# EAGLE design Joystick_final_rev02 (EAGLE 9.6.2)
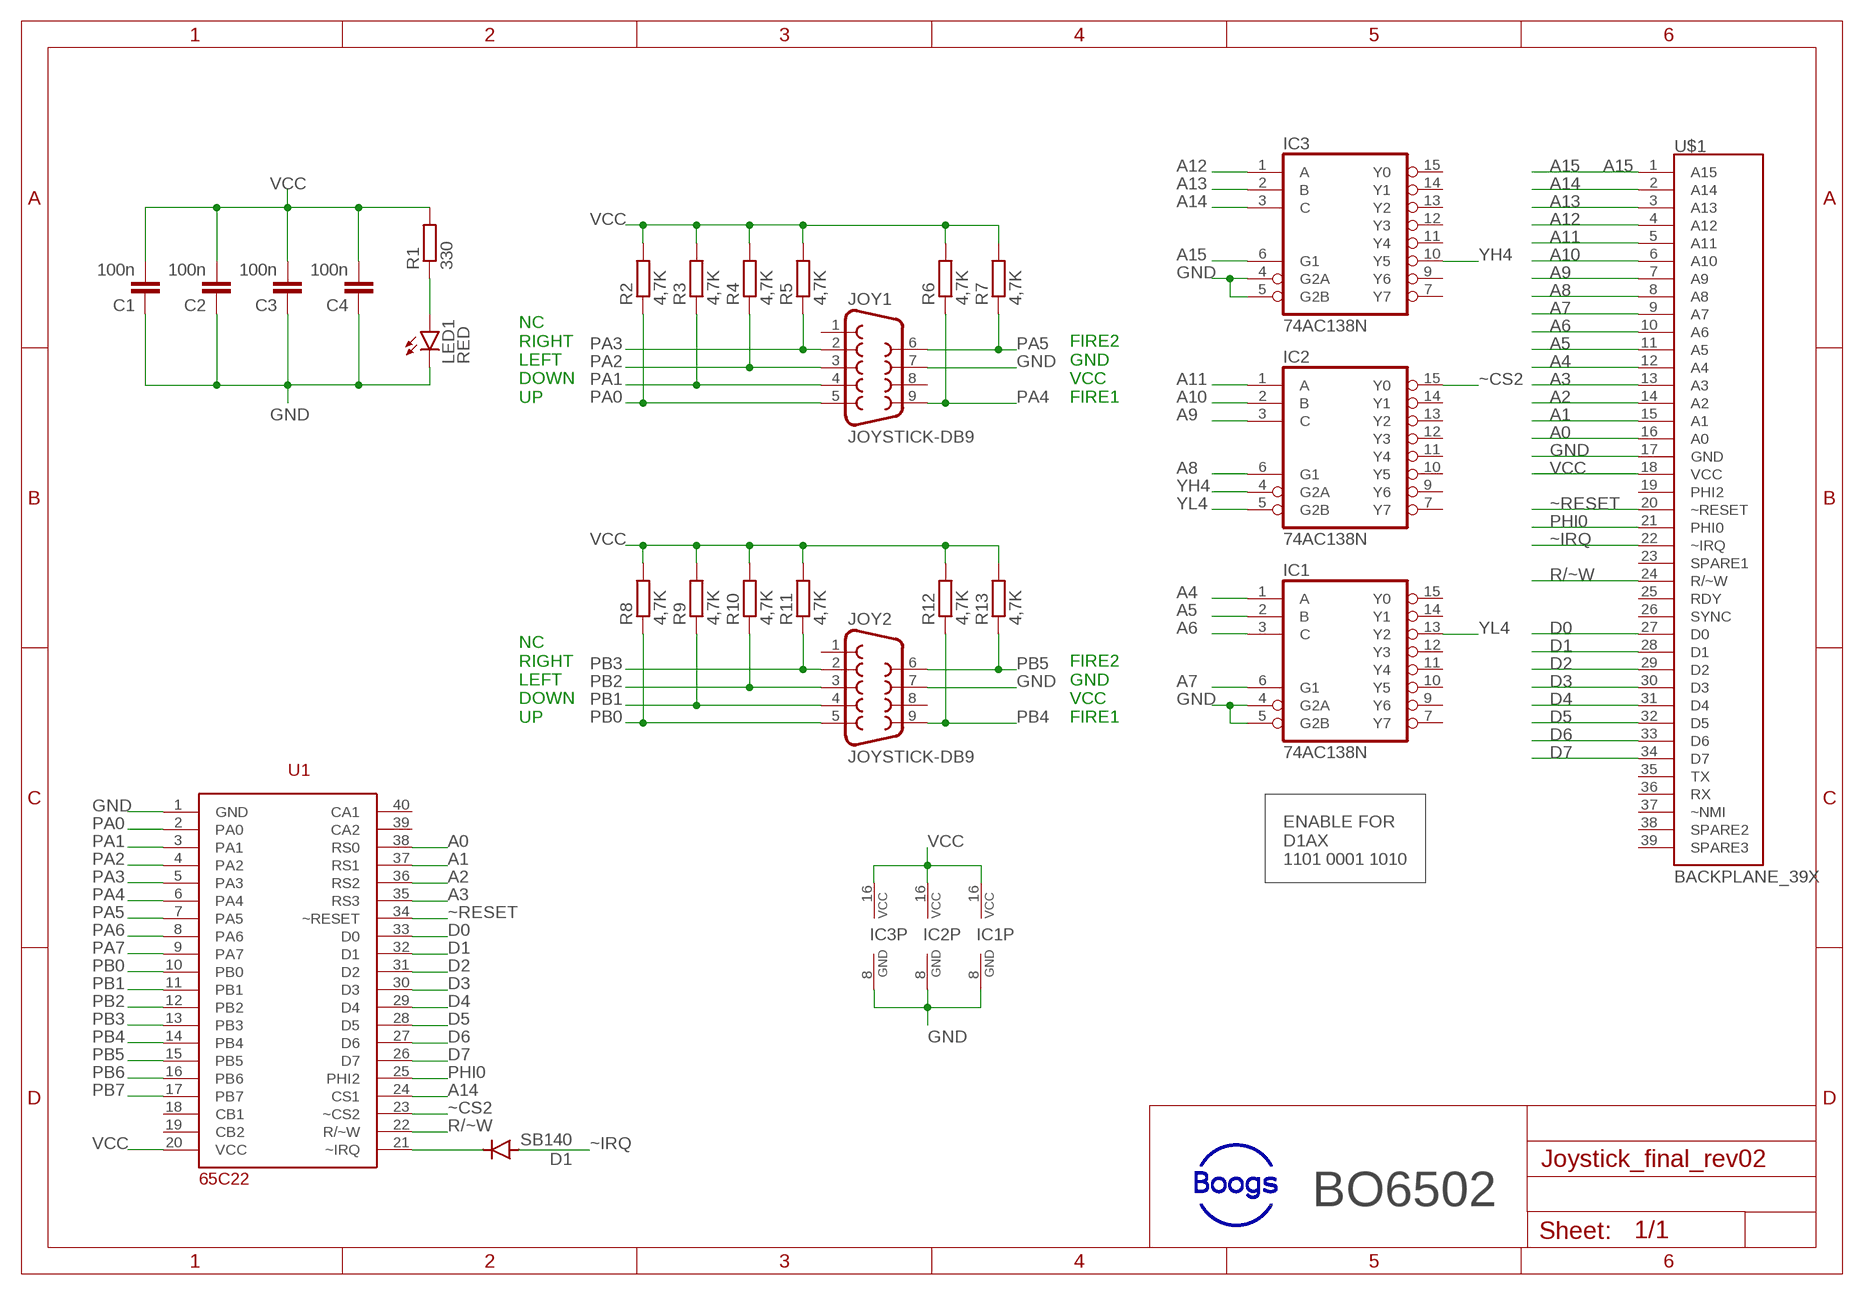
[diagram p0: schematic, sheet 1]

## Parts
C1  100n  C-EU025-025X050  [C025-025X050]
C2  100n  C-EU025-025X050  [C025-025X050]
C3  100n  C-EU025-025X050  [C025-025X050]
C4  100n  C-EU025-025X050  [C025-025X050]
D1  SB140  1N4004  [DO41-10]
IC1  74AC138N  [DIL16]
IC2  74AC138N  [DIL16]
IC3  74AC138N  [DIL16]
JOY1  JOYSTICK-DB9  F09HP  [F09HP]
JOY2  JOYSTICK-DB9  F09HP  [F09HP]
LED1  RED  LED5MM  [LED5MM]
R1  330  R-EU_0207/10  [0207/10]
R2  4,7K  R-EU_0207/10  [0207/10]
R3  4,7K  R-EU_0207/10  [0207/10]
R4  4,7K  R-EU_0207/10  [0207/10]
R5  4,7K  R-EU_0207/10  [0207/10]
R6  4,7K  R-EU_0207/10  [0207/10]
R7  4,7K  R-EU_0207/10  [0207/10]
R8  4,7K  R-EU_0207/10  [0207/10]
R9  4,7K  R-EU_0207/10  [0207/10]
R10  4,7K  R-EU_0207/10  [0207/10]
R11  4,7K  R-EU_0207/10  [0207/10]
R12  4,7K  R-EU_0207/10  [0207/10]
R13  4,7K  R-EU_0207/10  [0207/10]
U1  65C22  [DIL40]
U$1  BACKPLANE_39X  [BP_39X]

## Nets
A0: U1.38(RS0) U$1.16(A0)
A1: U1.37(RS1) U$1.15(A1)
A2: U1.36(RS2) U$1.14(A2)
A3: U1.35(RS3) U$1.13(A3)
A4: IC1.1(A) U$1.12(A4)
A5: IC1.2(B) U$1.11(A5)
A6: IC1.3(C) U$1.10(A6)
A7: IC1.6(G1) U$1.9(A7)
A8: IC2.6(G1) U$1.8(A8)
A9: IC2.3(C) U$1.7(A9)
A10: IC2.2(B) U$1.6(A10)
A11: IC2.1(A) U$1.5(A11)
A12: IC3.1(A) U$1.4(A12)
A13: IC3.2(B) U$1.3(A13)
A14: IC3.3(C) U1.24(CS1) U$1.2(A14)
A15: IC3.6(G1) U$1.1(A15)
D0: U1.33(D0) U$1.27(D0)
D1: U1.32(D1) U$1.28(D1)
D2: U1.31(D2) U$1.29(D2)
D3: U1.30(D3) U$1.30(D3)
D4: U1.29(D4) U$1.31(D4)
D5: U1.28(D5) U$1.32(D5)
D6: U1.27(D6) U$1.33(D6)
D7: U1.26(D7) U$1.34(D7)
GND: C1.1 C2.1 C3.1 C4.1 IC1.4(G2A) IC1.5(G2B) IC1.8(GND) IC2.8(GND) IC3.4(G2A) IC3.5(G2B) IC3.8(GND) JOY1.7 JOY2.7 LED1.K(C) U1.1(GND) U$1.17(GND)
N$1: D1.C U1.21(~IRQ)
N$6: LED1.A R1.1
PA0: JOY1.5 R2.1 U1.2(PA0)
PA1: JOY1.4 R3.1 U1.3(PA1)
PA2: JOY1.3 R4.1 U1.4(PA2)
PA3: JOY1.2 R5.1 U1.5(PA3)
PA4: JOY1.9 R6.1 U1.6(PA4)
PA5: JOY1.6 R7.1 U1.7(PA5)
PA6: U1.8(PA6)
PA7: U1.9(PA7)
PB0: JOY2.5 R8.1 U1.10(PB0)
PB1: JOY2.4 R9.1 U1.11(PB1)
PB2: JOY2.3 R10.1 U1.12(PB2)
PB3: JOY2.2 R11.1 U1.13(PB3)
PB4: JOY2.9 R12.1 U1.14(PB4)
PB5: JOY2.6 R13.1 U1.15(PB5)
PB6: U1.16(PB6)
PB7: U1.17(PB7)
PHI0: U1.25(PHI2) U$1.21(PHI0)
R/~W: U1.22(R/~W) U$1.24(R/~W)
VCC: C1.2 C2.2 C3.2 C4.2 IC1.16(VCC) IC2.16(VCC) IC3.16(VCC) R1.2 R2.2 R3.2 R4.2 R5.2 R6.2 R7.2 R8.2 R9.2 R10.2 R11.2 R12.2 R13.2 U1.20(VCC) U$1.18(VCC)
YH4: IC2.4(G2A) IC3.10(Y5)
YL4: IC1.13(Y2) IC2.5(G2B)
~CS2: IC2.15(Y0) U1.23(~CS2)
~IRQ: D1.A U$1.22(~IRQ)
~RESET: U1.34(~RESET) U$1.20(~RESET)
Unconnected: IC1.7(Y7) IC1.9(Y6) IC1.10(Y5) IC1.11(Y4) IC1.12(Y3) IC1.14(Y1) IC1.15(Y0) IC2.7(Y7) IC2.9(Y6) IC2.10(Y5) IC2.11(Y4) IC2.12(Y3) IC2.13(Y2) IC2.14(Y1) IC3.7(Y7) IC3.9(Y6) IC3.11(Y4) IC3.12(Y3) IC3.13(Y2) IC3.14(Y1) IC3.15(Y0) JOY1.1 JOY1.8 JOY2.1 JOY2.8 U1.18(CB1) U1.19(CB2) U1.39(CA2) U1.40(CA1) U$1.19(PHI2) U$1.23(SPARE1) U$1.25(RDY) U$1.26(SYNC) U$1.35(TX) U$1.36(RX) U$1.37(~NMI) U$1.38(SPARE2) U$1.39(SPARE3)

## Notes on the sheet
- NC
  RIGHT
  LEFT
  DOWN
  UP
- FIRE2
  GND
  VCC
  FIRE1
- NC
  RIGHT
  LEFT
  DOWN
  UP
- FIRE2
  GND
  VCC
  FIRE1
- ENABLE FOR
  D1AX
  1101 0001 1010
- BO6502

## Library data of the parts
C1-C4 = rcl:C-EU: CAPACITOR, European symbol; SPICEPREFIX: C
D1 = diode:1N4004: DIODE general purpose rectifier, 1 A
IC1-IC3 = 74xx-eu:74*138: 3-line to 8-line DECODER/DEMULTIPLEXER
JOY1 JOY2 = con-subd:F09: SUB-D; OC_FARNELL: unknown; OC_NEWARK: unknown
LED1 = led:LED: LED OSRAM: - CHIPLED LG R971, LG N971, LY N971, LG Q971, LY Q971, LO R971, LY R971 LH N974, LH R974 LS Q976, LO Q976, LY Q976 LO Q996 - Hyper CHIPLED LW Q18S LB Q993, LB Q99A, LB R99A - SideLED LS A670, LO A670, LY A670, LG A670, LP A670 LB A673, LV A673, LT A673, LW A673 LH A674 LY A675 LS A676, LA A676, LO A676, LY A676, LW A676 LS A679, LY A679, LG A679 - Hyper Micro SIDELED® LS Y876, LA Y876, LO Y876, LY Y876 LT Y87S - SmartLED LW L88C, LW L88S LB L89C, LB L89S, LG L890 LS L89K, LO L89K, LY L89K LS L896, LA L896, LO L896, LY L896 - TOPLED LS T670, LO T670, LY T670, LG T670, LP T670 LSG T670, LSP T670, LSY T670, LOP T670, LYG T670 LG T671, LOG T671, LSG T671 LB T673, LV T673, LT T673, LW T673 LH T674 LS T676, LA T676, LO T676, LY T676, LB T676, LH T676, LSB T676, LW T676 LB T67C, LV T67C, LT T67C, LS T67K, LO T67K, LY T67K, LW E67C LS E67B, LA E67B, LO E67B, LY E67B, LB E67C, LV E67C, LT E67C LW T67C LS T679, LY T679, LG T679 LS T770, LO T770, LY T770, LG T770, LP T770 LB T773, LV T773, LT T773, LW T773 LH T774 LS E675, LA E675, LY E675, LS T675 LS T776, LA T776, LO T776, LY T776, LB T776 LHGB T686 LT T68C, LB T68C - Hyper Mini TOPLED® LB M676 - Mini TOPLED Santana® LG M470 LS M47K, LO M47K, LY M47K Source: http://www.osram.convergy.de LUXEON: - LUMILED® LXK2-PW12-R00, LXK2-PW12-S00, LXK2-PW14-U00, LXK2-PW14-V00 LXK2-PM12-R00, LXK2-PM12-S00, LXK2-PM14-U00 LXK2-PE12-Q00, LXK2-PE12-R00, LXK2-PE12-S00, LXK2-PE14-T00, LXK2-PE14-U00 LXK2-PB12-K00, LXK2-PB12-L00, LXK2-PB12-M00, LXK2-PB14-N00, LXK2-PB14-P00, LXK2-PB14-Q00 LXK2-PR12-L00, LXK2-PR12-M00, LXK2-PR14-Q00, LXK2-PR14-R00 LXK2-PD12-Q00, LXK2-PD12-R00, LXK2-PD12-S00 LXK2-PH12-R00, LXK2-PH12-S00 LXK2-PL12-P00, LXK2-PL12-Q00, LXK2-PL12-R00 Source: www.luxeon.com KINGBRIGHT: KA-3528ASYC Source: www.kingbright.com
R1-R13 = rcl:R-EU_: RESISTOR, European symbol; SPICEPREFIX: R
U1 = 65xx_family:65C22
U$1 = 65xx_family:BACKPLANE_39X; A15: A15

## Board
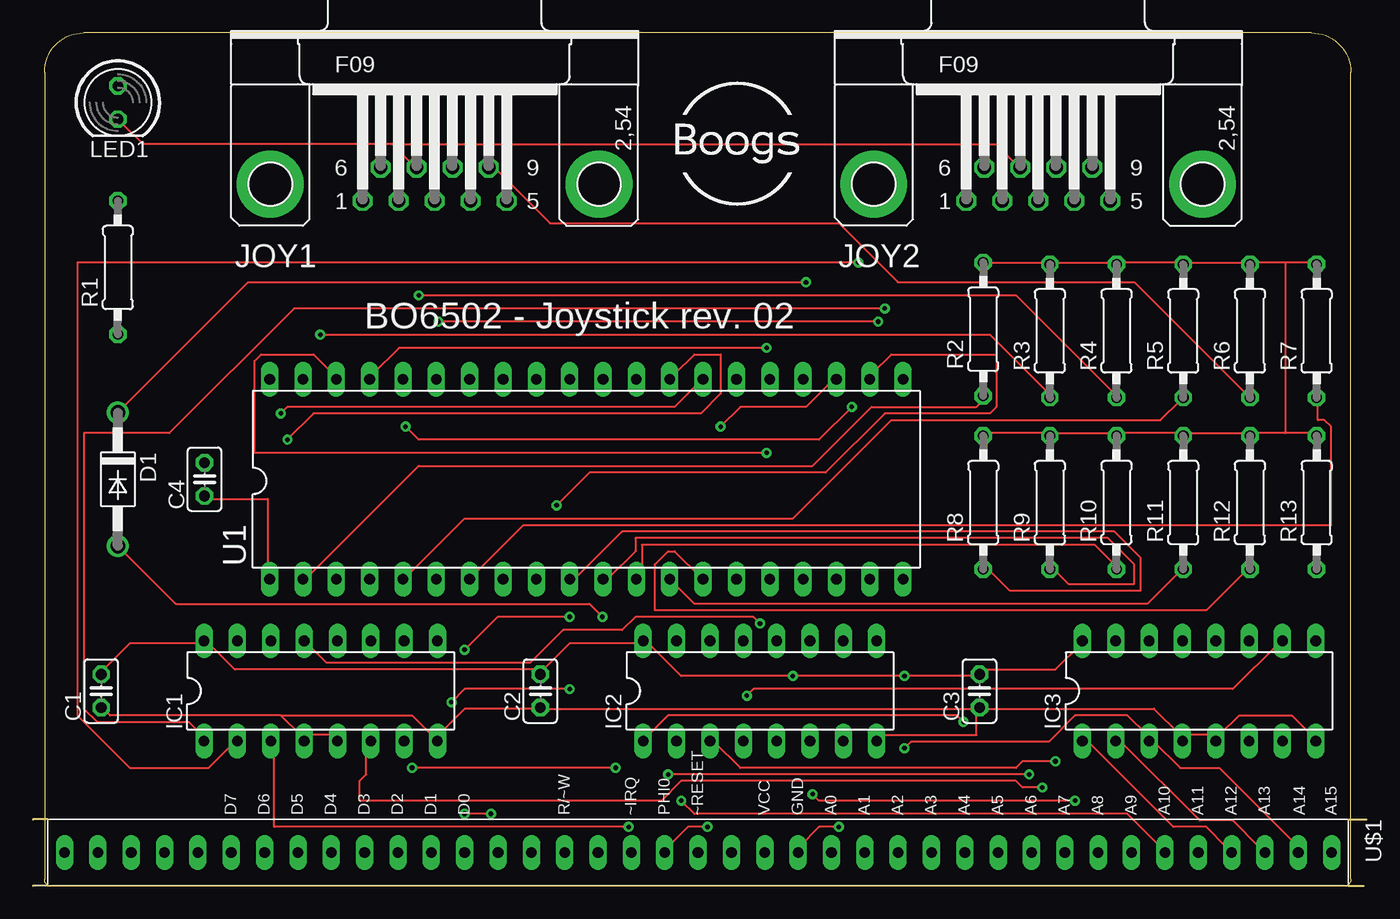
[diagram p1: board, top side]
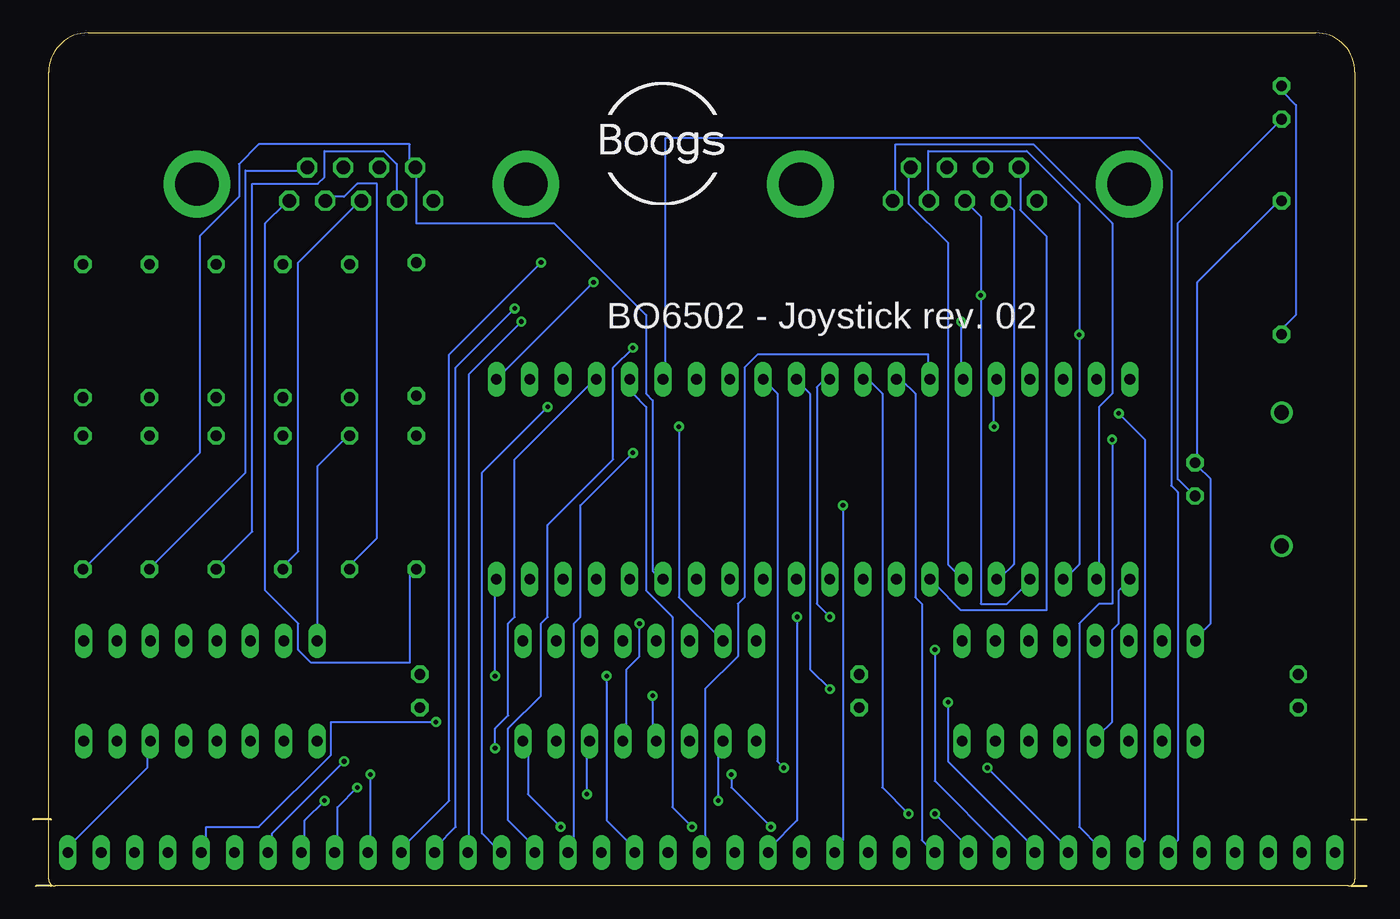
[diagram p2: board, bottom side, seen from below]

Size 101.6 x 65 mm. Coordinates in mm from the lower left corner, seen from the top.
Outline: 1.14,5.08 0,5.08
Outline: 1.14,0 0,0
Outline: 100.2,5.08 101.6,5.08
Outline: 100.2,0 101.35,0
Outline: 1.39,0 99.89,0 arc90 100.39,0.5 100.39,62 arc90 97.39,65 3.89,65 arc90 0.89,62 0.89,0.5 arc90 1.39,0
Copper layers (1*16): Top 0.035mm / dielectric 1.5mm / Bottom 0.035mm
Design rules "default *": minimum track width 6mil, minimum drill 0.35mm, track to track 10mil, track to pad 10mil, pad to pad 10mil, via to via 10mil, smd to smd 6mil, copper to edge 40mil, drill to drill 6mil, minimum pad ring 10mil, minimum via ring 8mil, stop-mask expansion 4mil, vias tented up to drill 15mil, thermal gap 10mil

### Footprints (pad centres in the part's own frame; a part is rotated, then mirrored left to right if it is on the bottom)
C025-025X050 = drill 0.813 octagon: 1 -1.27,0; 2 1.27,0
DO41-10 = drill 1.118: A 5.08,0; C -5.08,0
DIL16 = drill 0.813 long: 1 -8.89,-3.81; 2 -6.35,-3.81; 3 -3.81,-3.81; 4 -1.27,-3.81; 5 1.27,-3.81; 6 3.81,-3.81; 7 6.35,-3.81; 8 8.89,-3.81; 9 8.89,3.81; 10 6.35,3.81; 11 3.81,3.81; 12 1.27,3.81; 13 -1.27,3.81; 14 -3.81,3.81; 15 -6.35,3.81; 16 -8.89,3.81
F09HP = drill 1.016 octagon: 1 -5.486,-1.27; 2 -2.743,-1.27; 3 0,-1.27; 4 2.743,-1.27; 5 5.486,-1.27; 6 -4.115,1.27; 7 -1.372,1.27; 8 1.372,1.27; 9 4.115,1.27 | drill 3.302 pad 5.08: G1 -12.522,0; G2 12.522,0
LED5MM = drill 0.813 octagon: A -1.27,0; K 1.27,0
0207/10 = drill 0.813 octagon: 1 -5.08,0; 2 5.08,0
DIL40 = drill 0.813 long: 1 -24.13,-7.62; 2 -21.59,-7.62; 3 -19.05,-7.62; 4 -16.51,-7.62; 5 -13.97,-7.62; 6 -11.43,-7.62; 7 -8.89,-7.62; 8 -6.35,-7.62; 9 -3.81,-7.62; 10 -1.27,-7.62; 11 1.27,-7.62; 12 3.81,-7.62; 13 6.35,-7.62; 14 8.89,-7.62; 15 11.43,-7.62; 16 13.97,-7.62; 17 16.51,-7.62; 18 19.05,-7.62; 19 21.59,-7.62; 20 24.13,-7.62; 21 24.13,7.62; 22 21.59,7.62; 23 19.05,7.62; 24 16.51,7.62; 25 13.97,7.62; 26 11.43,7.62; 27 8.89,7.62; 28 6.35,7.62; 29 3.81,7.62; 30 1.27,7.62; 31 -1.27,7.62; 32 -3.81,7.62; 33 -6.35,7.62; 34 -8.89,7.62; 35 -11.43,7.62; 36 -13.97,7.62; 37 -16.51,7.62; 38 -19.05,7.62; 39 -21.59,7.62; 40 -24.13,7.62
BP_39X = drill 0.813 long: 1 1.27,59.69; 2 1.27,57.15; 3 1.27,54.61; 4 1.27,52.07; 5 1.27,49.53; 6 1.27,46.99; 7 1.27,44.45; 8 1.27,41.91; 9 1.27,39.37; 10 1.27,36.83; 11 1.27,34.29; 12 1.27,31.75; 13 1.27,29.21; 14 1.27,26.67; 15 1.27,24.13; 16 1.27,21.59; 17 1.27,19.05; 18 1.27,16.51; 19 1.27,13.97; 20 1.27,11.43; 21 1.27,8.89; 22 1.27,6.35; 23 1.27,3.81; 24 1.27,1.27; 25 1.27,-1.27; 26 1.27,-3.81; 27 1.27,-6.35; 28 1.27,-8.89; 29 1.27,-11.43; 30 1.27,-13.97; 31 1.27,-16.51; 32 1.27,-19.05; 33 1.27,-21.59; 34 1.27,-24.13; 35 1.27,-26.67; 36 1.27,-29.21; 37 1.27,-31.75; 38 1.27,-34.29; 39 1.27,-36.83

### Placement (x,y rotation side)
C1  5.21,14.86 90 top
C2  38.66,14.86 90 top
C3  72.11,14.86 90 top
C4  13.08,30.99 90 top
D1  6.48,30.99 270 top
IC1  21.93,14.86 0 top
IC2  55.38,14.86 0 top
IC3  88.84,14.86 0 top
JOY1  30.61,53.47 0 top
JOY2  76.58,53.47 0 top
LED1  6.48,59.69 270 top
R1  6.48,47.12 90 top
R2  72.39,42.42 90 top
R3  77.47,42.29 90 top
R4  82.55,42.29 90 top
R5  87.63,42.29 90 top
R6  92.71,42.29 90 top
R7  97.79,42.29 90 top
R8  72.39,29.21 90 top
R9  77.47,29.21 90 top
R10  82.55,29.21 90 top
R11  87.63,29.21 90 top
R12  92.71,29.21 90 top
R13  97.79,29.21 90 top
U1  42.16,30.99 0 top
U$1  39.24,3.81 270 top

### Tracks (layer width: path | path; a pad name or v marks a point on that pad's centre or on a via)
A0  (via drill 0.35)
  Top 0.152: v55.89,33 16.89,33 16.89,40 17.39,40.5 21.39,40.5 22.89,39 U1.38
  Bottom 0.152: v55.89,33 59.89,29 59.89,20.5 60.39,20 60.39,3 U$1.16
A1  (via drill 0.35)
  Top 0.152: v55.89,41 27.89,41 25.89,39 U1.37
  Bottom 0.152: v55.89,41 57.39,39.5 57.39,32.5 62.39,27.5 62.39,20.5 62.89,20 62.89,14.5 65.39,12 65.39,5 63.39,3 U$1.15
A2  (via drill 0.35)
  Top 0.152: v28.39,35 29.39,34 59.89,34 v62.39,36.5
  Bottom 0.152: v28.39,35 28.39,38.5 U1.36 | v62.39,36.5 67.39,31.5 67.39,4 66.39,3 U$1.14
A3  (via drill 0.35)
  Top 0.152: v64.39,43 v30.89,43
  Bottom 0.152: v30.89,43 30.89,39 U1.35 | v64.39,43 68.39,39 68.39,3 U$1.13
A4  (via drill 0.35)
  Top 0.152: v64.89,44 19.89,44 10.39,34.5 3.89,34.5 3.89,13.5 4.89,12.5 11.89,12.5 12.89,11.5 IC1.1
  Bottom 0.152: v64.89,44 69.39,39.5 69.39,4.5 70.89,3 U$1.12
A5  (via drill 0.35)
  Top 0.152: v62.89,47.5 3.39,47.5 3.39,13 7.39,9 13.39,9 15.39,11 IC1.2
  Bottom 0.152: v62.89,47.5 69.89,40.5 69.89,6.5 73.39,3 U$1.11
A6  (via drill 0.35)
  Top 0.152: v45.39,4.5 18.39,4.5 18.39,11 IC1.3 | v75.89,8.5 v48.39,8.5
  Bottom 0.152: v45.39,4.5 48.39,7.5 v48.39,8.5 | v75.89,8.5 75.89,3 U$1.10
A7  (via drill 0.35)
  Top 0.152: v76.89,7.5 75.39,7.5 74.89,8 49.39,8 47.89,6.5 24.89,6.5 24.89,8 25.39,8.5 25.39,11 IC1.6
  Bottom 0.152: v76.89,7.5 78.39,6 78.39,3 U$1.9
A8  (via drill 0.35)
  Top 0.152: v59.39,7 59.89,6.5 v79.39,6.5
  Bottom 0.152: v59.39,7 59.39,11 IC2.6 | v79.39,6.5 80.89,5 80.89,3 U$1.8
A9  (via drill 0.35)
  Top 0.152: v77.89,9.5 75.39,9.5 74.89,9 53.89,9 51.89,11 IC2.3
  Bottom 0.152: v77.89,9.5 83.39,4 83.39,3 U$1.7
A10  (via drill 0.35)
  Top 0.152: v49.39,6.5 50.39,5.5 83.39,5.5 85.89,3 U$1.6
  Bottom 0.152: v49.39,6.5 49.39,11 IC2.2
A11  (via drill 0.35)
  Top 0.152: v70.89,12.5 70.39,13 48.39,13 46.89,11.5 IC2.1
  Bottom 0.152: v70.89,12.5 78.89,12.5 78.89,10 84.39,4.5 88.39,4.5 88.39,3 U$1.5
A12
  Top 0.152: IC3.1 80.39,11 86.89,4.5 89.39,4.5 90.89,3 U$1.4
A13
  Top 0.152: IC3.2 82.89,11 88.89,5 91.39,5 93.39,3 U$1.3
A14  (via drill 0.35)
  Top 0.152: v66.39,10.5 66.89,11 77.39,11 79.39,13 83.39,13 84.89,11.5 IC3.3 85.39,11 87.39,9 90.39,9 96.39,3 U$1.2
  Bottom 0.152: v66.39,10.5 66.39,12 65.39,13 65.39,20 64.89,20.5 64.89,32.5 58.89,38.5 U1.24
A15
  Bottom 0.152: U$1.1 98.89,3 92.89,9 92.89,11 IC3.6
D0
  Bottom 0.152: U$1.27 33.39,3 33.89,3.5 33.89,21.5 34.39,22 34.39,37.5 35.39,38.5 U1.33
D1  (via drill 0.35)
  Top 0.152: v34.89,5.5 v32.89,5.5
  Bottom 0.152: v32.89,5.5 30.39,3 U$1.28 | v34.89,5.5 36.89,7.5 36.89,37.5 37.89,38.5 U1.32
D2  (via drill 0.35)
  Top 0.152: v32.89,18 35.39,20.5 v40.89,20.5
  Bottom 0.152: v32.89,18 32.89,8 27.89,3 U$1.29 | v40.89,20.5 41.89,21.5 41.89,38 41.39,38.5 U1.31
D3  (via drill 0.35)
  Top 0.152: v31.89,14 32.89,15 v40.89,15
  Bottom 0.152: v31.89,14 31.89,9.5 25.39,3 U$1.30 | v40.89,15 42.39,16.5 42.39,37.5 43.39,38.5 U1.30
D4  (via drill 0.35)
  Top 0.152: v44.39,9 v28.89,9
  Bottom 0.152: v28.89,9 22.89,3 U$1.31 | v44.39,9 44.89,9.5 44.89,37.5 45.89,38.5 U1.29
D5  (via drill 0.35)
  Top 0.152: v19.39,34 21.39,36 50.89,36 52.39,37.5 52.39,40.5 50.39,40.5 48.89,39 U1.28
  Bottom 0.152: v19.39,34 19.39,21.5 20.39,21.5 21.89,20 21.89,4.5 20.39,3 U$1.32
D6  (via drill 0.35)
  Top 0.152: v18.89,36 19.39,36.5 48.89,36.5 50.89,38.5 U1.27
  Bottom 0.152: v18.89,36 16.89,34 16.89,3.5 17.39,3 U$1.33
D7
  Bottom 0.152: U$1.34 14.89,3 14.39,3.5 14.39,30 14.89,30.5 14.89,54.5 17.39,57 53.39,57 53.39,39 U1.26
GND  (via drill 0.35)
  Top 0.152: 27.39,56.5 8.39,56.5 6.89,58 LED1.K | 27.39,56.5 28.89,55 JOY1.7 | 27.39,56.5 73.39,56.5 74.89,55 JOY2.7 | IC3.8 97.39,11.5 95.89,13 91.89,13 90.39,11.5 IC3.5 89.89,11.5 87.89,11.5 IC3.4 87.39,11.5 85.39,13.5 72.39,13.5 C3.1 71.89,13.5 | v61.39,4.5 59.89,4.5 58.39,3 U$1.17 | 71.89,13.5 71.89,11.5 64.39,11.5 IC2.8 | U1.1 17.89,23.5 17.89,29.5 13.39,29.5 C4.1 | IC1.5 22.89,11.5 20.89,11.5 IC1.4 20.39,11.5 18.89,13 | 18.89,13 5.89,13 5.39,13.5 C1.1 | 18.89,13 28.89,13 30.39,11.5 IC1.8 30.89,11.5 32.89,13.5 38.39,13.5 C2.1 38.89,13.5 71.89,13.5
  Bottom 0.152: v61.39,4.5 63.89,7 63.89,11 IC2.8 | U1.1 18.39,23 18.89,22.5 18.89,20 19.39,19.5 19.39,12.5 20.39,11.5 IC1.4 | LED1.K 6.89,58 14.39,50.5 14.39,31 13.39,30 C4.1
N$1  (via drill 0.35)
  Top 0.152: v58.89,46 16.39,46 6.89,36.5 D1.C
  Bottom 0.152: v58.89,46 65.89,39 U1.21
N$6
  Bottom 0.152: R1.1 6.39,42.5 5.39,43.5 5.39,59.5 6.39,60.5 LED1.A
PA0
  Top 0.152: R2.1 72.39,37 71.89,36.5 63.89,36.5 59.39,32 29.39,32 20.89,23.5 U1.2
  Bottom 0.152: U1.2 20.39,23.5 20.39,36.5 19.39,37.5 19.39,50.5 25.39,56.5 35.89,56.5 35.89,52.5 JOY1.5
PA1  (via drill 0.35)
  Top 0.152: v21.89,42 72.89,42 77.39,37.5 R3.1
  Bottom 0.152: U1.3 22.89,23.5 21.89,24.5 v21.89,42 21.89,52 25.89,56 33.39,56 33.39,52.5 JOY1.4
PA2  (via drill 0.35)
  Top 0.152: v29.39,45 74.89,45 82.39,37.5 R4.1
  Bottom 0.152: U1.4 25.89,23 27.39,21.5 29.39,21.5 v29.39,45 29.39,51 30.39,52 JOY1.3
PA3
  Top 0.152: R5.1 87.39,37 85.89,35.5 65.39,35.5 57.89,28 32.89,28 28.39,23.5 U1.5
  Bottom 0.152: U1.5 27.89,23.5 26.89,24.5 26.89,51.5 27.39,52 JOY1.2
PA4
  Top 0.152: R6.1 92.39,37.5 83.89,46 65.89,46 61.39,50.5 39.39,50.5 35.39,54.5 34.89,54.5 JOY1.9
  Bottom 0.152: U1.6 30.89,23.5 31.89,24.5 31.89,49 34.89,52 34.89,54.5 JOY1.9
PA5
  Top 0.152: R7.1 97.89,37 97.89,35.5 98.39,35.5 98.89,35 98.89,27.5 37.39,27.5 33.39,23.5 U1.7
  Bottom 0.152: U1.7 32.89,23 30.89,21 24.39,21 24.39,49.5 26.39,51.5 26.39,54.5 JOY1.6
PB0
  Top 0.152: U1.10 41.39,23.5 44.89,27 82.39,27 84.39,25 84.39,22.5 74.39,22.5 72.89,24 R8.1
  Bottom 0.152: JOY2.5 82.39,52 83.89,50.5 83.89,22.5 81.39,20 81.39,18 80.39,17 72.89,17 72.89,24 R8.1
PB1
  Top 0.152: U1.11 43.89,23.5 45.89,25.5 45.89,26.5 81.89,26.5 83.89,24.5 83.89,23 78.89,23 77.89,24 R9.1
  Bottom 0.152: JOY2.4 78.89,52.5 77.89,52.5 76.89,53.5 75.39,53.5 75.39,26.5 77.39,24.5 R9.1
PB2
  Top 0.152: U1.12 46.39,23.5 46.39,26 80.89,26 82.39,24.5 R10.1
  Bottom 0.152: JOY2.3 76.89,52 81.39,47.5 81.39,25.5 82.39,24.5 R10.1
PB3
  Top 0.152: U1.13 48.89,23 50.39,21.5 84.89,21.5 87.39,24 R11.1
  Bottom 0.152: JOY2.2 73.89,52.5 73.89,55 74.89,56 79.39,56 79.39,54 79.89,53.5 84.89,53.5 84.89,27 87.39,24.5 R11.1
PB4
  Top 0.152: U1.14 50.89,23.5 48.89,25.5 48.39,25.5 47.39,24.5 47.39,21 89.39,21 92.39,24 R12.1
  Bottom 0.152: JOY2.9 80.89,54.5 85.39,54.5 85.39,31.5 92.39,24.5 R12.1
PB5
  Bottom 0.152: U1.15 53.89,23.5 54.39,24 54.39,37 54.89,37.5 54.89,43.5 61.89,50.5 72.39,50.5 72.39,54.5 JOY2.6 72.89,55 72.89,56.5 84.39,56.5 85.89,55 85.89,52.5 88.89,49.5 88.89,33 97.39,24.5 R13.1
PHI0  (via drill 0.35)
  Top 0.152: v51.39,4.5 49.89,4.5 48.39,3 U$1.21
  Bottom 0.152: v51.39,4.5 52.89,6 52.89,20.5 54.89,22.5 54.89,36.5 55.89,37.5 55.89,38.5 U1.25
R/~W  (via drill 0.35)
  Top 0.152: v39.89,29 42.39,31.5 60.39,31.5 64.89,36 72.89,36 73.39,36.5 73.39,40.5 65.39,40.5 63.89,39 U1.22
  Bottom 0.152: v39.89,29 39.89,3.5 40.39,3 U$1.24
VCC  (via drill 0.35)
  Top 0.152: C1.2 5.39,16.5 7.39,18.5 12.89,18.5 IC1.16 13.39,18.5 15.39,16.5 38.39,16.5 C2.2 38.89,16.5 40.89,18.5 46.39,18.5 IC2.16 46.89,18.5 49.39,16 v57.89,16 v66.39,16 71.89,16 C3.2 72.39,16.5 77.89,16.5 79.89,18.5 IC3.16 | 95.39,34.5 97.39,34.5 R13.2 | 95.39,34.5 92.89,34.5 R12.2 92.39,34.5 87.89,34.5 R11.2 87.39,34.5 82.89,34.5 R10.2 82.39,34.5 77.89,34.5 R9.2 77.39,34.5 72.89,34.5 R8.2 | 95.39,47.5 97.39,47.5 R7.2 | 95.39,47.5 92.89,47.5 R6.2 92.39,47.5 87.89,47.5 R5.2 87.39,47.5 82.89,47.5 R4.2 82.39,47.5 77.89,47.5 R3.2 77.39,47.5 72.89,47.5 R2.2 | 95.39,47.5 95.39,34.5
  Bottom 0.152: IC1.16 12.89,19 11.89,20 11.89,31 12.89,32 C4.2 12.89,32.5 12.89,46 6.89,52 R1.2 | v57.89,16 57.89,5 55.89,3 U$1.18 | v66.39,16 66.39,23 U1.20 | R9.2 77.89,34 79.89,32 79.89,19 IC3.16
YH4  (via drill 0.35)
  Top 0.152: v54.39,14.5 54.89,15 91.39,15 94.89,18.5 IC3.10
  Bottom 0.152: v54.39,14.5 54.39,11.5 IC2.4
YL4  (via drill 0.35)
  Top 0.152: v55.39,20 54.89,20.5 45.89,20.5 44.89,19.5 40.39,19.5 37.89,17 22.39,17 20.89,18.5 IC1.13
  Bottom 0.152: v55.39,20 55.39,17.5 56.39,16.5 56.39,11.5 IC2.5
~CS2  (via drill 0.35)
  Top 0.152: v52.39,35 53.89,36.5 58.89,36.5 60.89,38.5 U1.23
  Bottom 0.152: v52.39,35 52.39,22 49.39,19 IC2.15
~IRQ  (via drill 0.35)
  Top 0.152: v43.39,20.5 42.39,21.5 10.89,21.5 6.89,25.5 D1.A
  Bottom 0.152: v43.39,20.5 43.39,5 45.39,3 U$1.22
~RESET
  Bottom 0.152: U$1.20 50.39,3 50.39,15 47.89,17.5 47.89,21.5 47.39,22 47.39,39.5 46.39,40.5 33.39,40.5 33.39,39 U1.34

### Text on the board
tNames: BO6502 - Joystick rev. 02 | D7 | D6 | D5 | D4 | D3 | D2 | D1 | D0 | R/~W | ~IRQ | PHI0 | ~RESET | VCC | GND | A0 | A1 | A2 | A3 | A4 | A5 | A6 | A7 | A8 | A9 | A10 | A11 | A12 | A13 | A14 | A15
bNames: BO6502 - Joystick rev. 02